# Altium schematic sheet Power.SchDoc
size A
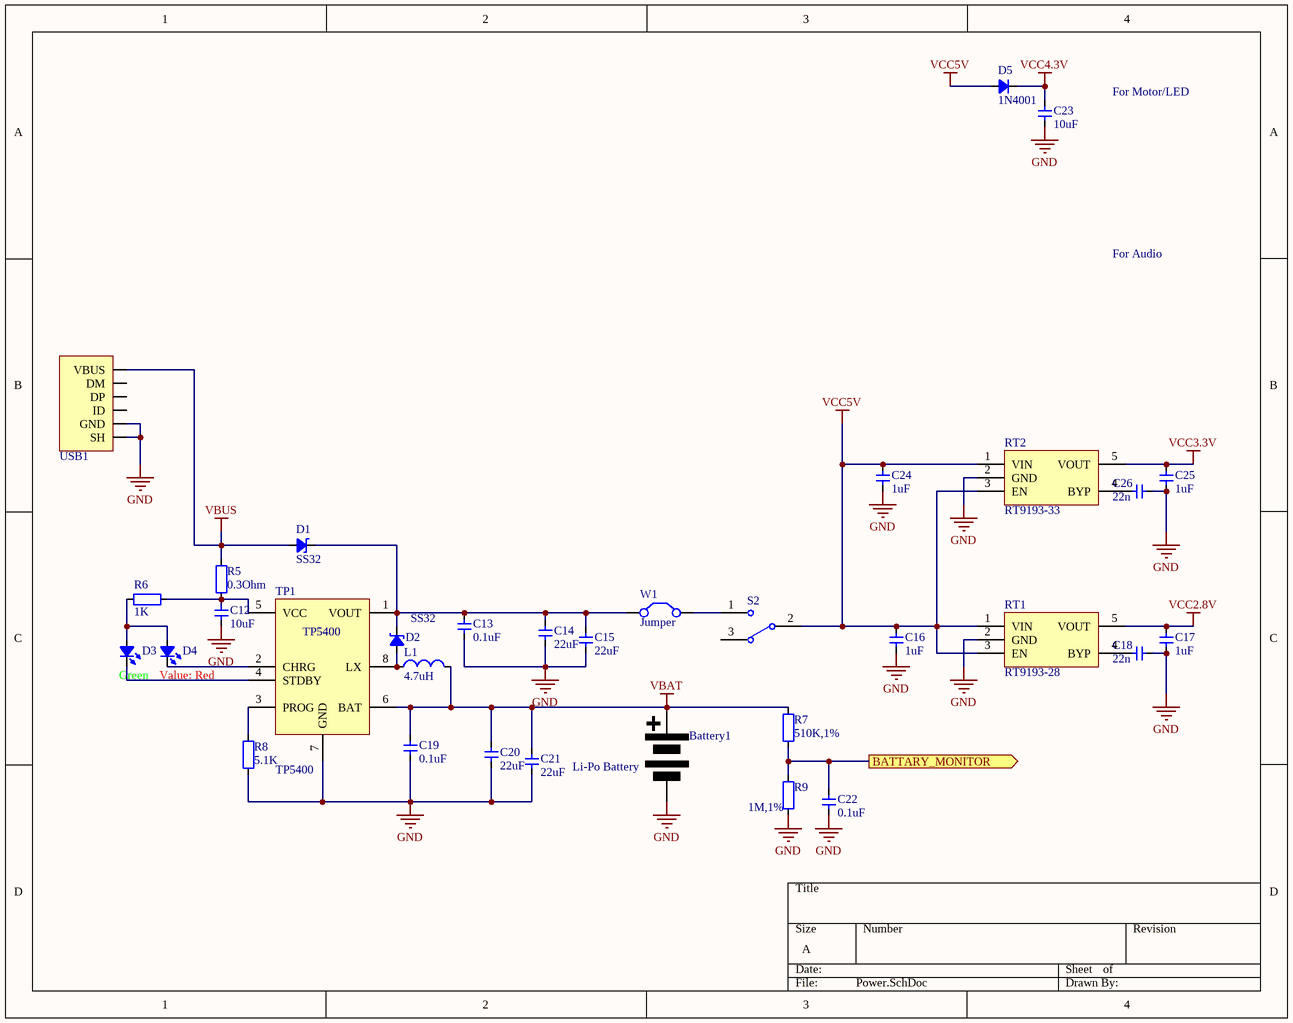
[diagram p0: Power.SchDoc]

## Parts
Battery1  Li-Po Battery  [HDR1X2_2.54_180]
C12  value 10uF  [CAP_0805]  (hidden comment: Cap_0805)
C13  value 0.1uF  [CAP_0603]  (hidden comment: Cap_0603)
C14  value 22uF  [CAP_0805]  (hidden comment: Cap_0805)
C15  value 22uF  [CAP_0805]  (hidden comment: Cap_0805)
C16  value 1uF  [CAP_0603]  (hidden comment: Cap_0603)
C17  value 1uF  [CAP_0603]  (hidden comment: Cap_0603)
C18  value 22n  [CAP_0402]  (hidden comment: Cap_0402)
C19  value 0.1uF  [CAP_0603]  (hidden comment: Cap_0603)
C20  value 22uF  [CAP_0805]  (hidden comment: Cap_0805)
C21  value 22uF  [CAP_0805]  (hidden comment: Cap_0805)
C22  value 0.1uF  [CAP_0603]  (hidden comment: Cap_0603)
C23  value 10uF  [CAP_0603]  (hidden comment: Cap_0603)
C24  value 1uF  [CAP_0603]  (hidden comment: Cap_0603)
C25  value 1uF  [CAP_0603]  (hidden comment: Cap_0603)
C26  value 22n  [CAP_0402]  (hidden comment: Cap_0402)
D1  value SS32  [DO-214AC]  (hidden comment: SchottkyDiode_SOD123)
D2  value SS32  [DO-214AC]  (hidden comment: SchottkyDiode_SOD123)
D3  value Green  [LED_0603_RED]  (hidden comment: Green LED 0603)
D4  value Red  [LED_0603_RED]  (hidden comment: Red LED 0603)
D5  value 1N4001  [DO-214AC]  (hidden comment: IN4001)
L1  value 4.7uH  [IND_CD32]  (hidden comment: Ind_CD32)
R5  value 0.3Ohm  [RES_0603]  (hidden comment: Res_0603)
R6  value 1K  [RES_0603]  (hidden comment: Res_0603)
R7  value 510K,1%  [RES_0603]  (hidden comment: Res_0603)
R8  value 5.1K  [RES_0603]  (hidden comment: Res_0603)
R9  value 1M,1%  [RES_0603]  (hidden comment: Res_0603)
RT1  RT9193-28  [SOT23-5]
RT2  RT9193-33  [SOT23-5]
S2  SwitchSPDT_2.8x6.6_90  [SwitchSPDT_2.8X6.6_90]  (value not drawn)
TP1  TP5400  [SOP_E150_8]
USB1  USB Mini-B  [USB_Micro-AB]  (value not drawn)
W1  Jumper  [HDR1X2]

## Ports
BATTARY_MONITOR (out)

## Nets
GND: Battery1.1(-) C12.2 C13.1 C14.2 C15.2 C16.2 C17.1 C18.2 C19.1 C20.2 C21.2 C22.2 C23.1 C24.2 C25.1 C26.2 R8.1 R9.1 RT1.2(GND) RT2.2(GND) TP1.7(GND) USB1.0(SH) USB1.5(GND)
VBAT: Battery1.2(+) C19.2 C20.1 C21.1 L1.2 R7.2 TP1.6(BAT)
VBUS: D1.1(A) R5.2 USB1.1(VBUS)
VCC2.8V: C17.2 RT1.5(VOUT)
VCC3.3V: C25.2 RT2.5(VOUT)
VCC4.3V: C23.2 D5.2(K)
VCC5V: C16.1 C24.1 D5.1(A) RT1.1(VIN) RT1.3(EN) RT2.1(VIN) RT2.3(EN) S2.2
BATTARY_MONITOR: C22.1 R7.1 R9.2 ; port BATTARY_MONITOR
NetC12_1: C12.1 R5.1 R6.2 TP1.5(VCC)
NetC13_2: C13.2 C14.1 C15.1 D1.2(K) D2.2(K) TP1.1(VOUT) W1.1(C1)
NetC18_1: C18.1 RT1.4(BYP)
NetC26_1: C26.1 RT2.4(BYP)
NetD2_1: D2.1(A) L1.1 TP1.8(LX)
NetD3_1: D3.1(A) D4.1(A) R6.1
NetD3_2: D3.2(K) TP1.4(STDBY)
NetD4_2: D4.2(K) TP1.2(CHRG)
NetR8_2: R8.2 TP1.3(PROG)
NetS2_1: S2.1 W1.2(C2)

Not connected (* = marked no-connect by the designer): S2 3; USB1 2(DM) 3(DP) 4(ID)

## Notes on the sheet
- For Motor/LED
- For Audio

## Library data of the parts
Battery1 = Battery_LiPo: Li-Po Rechargable Battery
C12 C14 C15 C20 C21 = Cap_0805: Capacitor
C13 C16 C17 C19 C22-C25 = Cap_0603: Capacitor
C18 C26 = Cap_0402: Capacitor
D1 D2 = SchottkyDiode_SOD123: Diode
D3 D4 = LED_0603: LED
D5 = Diode_SMA: Diode
L1 = Ind_CD32: Inductor
R5-R9 = Res_0603: Resistor
RT1 RT2 = RT9193: Power
S2 = SwitchSPDT_2.8x6.6_90: Switch
TP1 = TP5400: Charge
USB1 = USB_Micro: USB
W1 = Jumper: Jumper Wire; Published: 24-Mar-1999; LatestRevisionDate: 17-Jul-2002; LatestRevisionNote: Re-released for DXP Platform.; PackageReference: RAD-0.2; Publisher: Altium Limited; PackageDescription: Radial Cap, Thru-Hole; 2 Leads; 0.2 in Pin Spacing